# Altium schematic sheet Fuse_Power.SchDoc
size A4
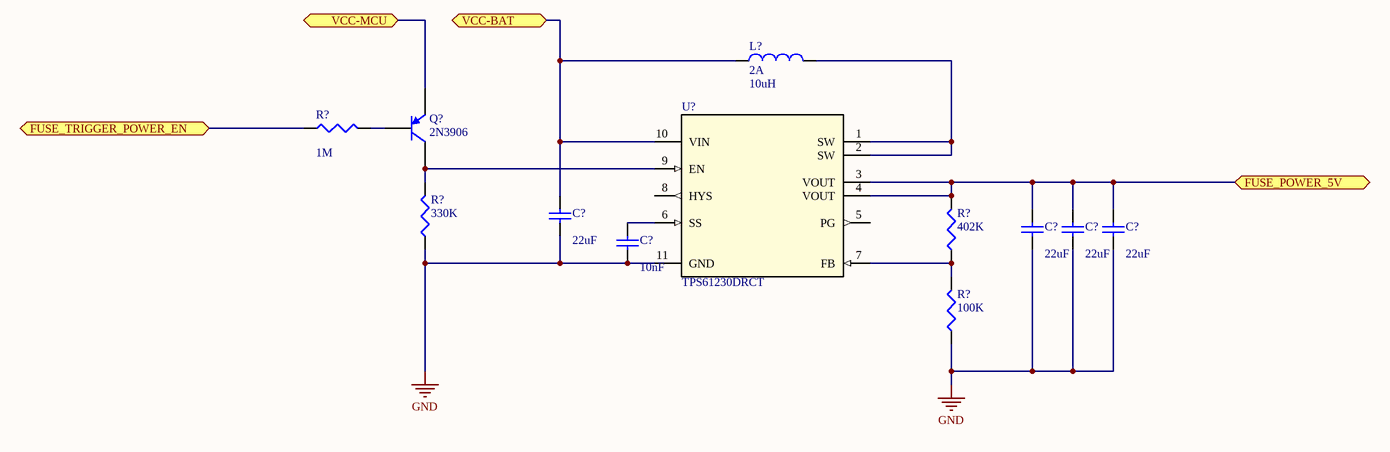
[diagram p0: Fuse_Power.SchDoc]

## Parts
(Parts that share a designator on the sheet are numbered #1, #2 ... from top to bottom, then left to right.)
C?#1  value 22uF  [C1206]  (hidden comment: Cap Semi)
C?#2  value 22uF  [C1206]  (hidden comment: Cap Semi)
C?#3  value 22uF  [C1206]  (hidden comment: Cap Semi)
C?#4  value 22uF  [C1206]  (hidden comment: Cap Semi)
C?#5  value 10nF  [C1206]  (hidden comment: Cap Semi)
L?  2A  value 10uH  [0402-A]
Q?  2N3906  [SOT-23B_N]
R?#1  value 1M  [12Z-2010]  (hidden comment: Res3)
R?#2  value 330K  [12Z-2010]  (hidden comment: Res3)
R?#3  value 402K  [12Z-2010]  (hidden comment: Res3)
R?#4  value 100K  [12Z-2010]  (hidden comment: Res3)
U?  TPS61230DRCT  [DRC0010G]

## Ports
FUSE_POWER_5V (bidir), FUSE_TRIGGER_POWER_EN (bidir), VCC-BAT (bidir), VCC-MCU (bidir)

## Nets
GND: C?#1.1 C?#2.1 C?#3.1 C?#4.1 C?#5.1 R?#2.1 R?#4.1 U?.11(GND)
FUSE_POWER_5V: C?#2.2 C?#3.2 C?#4.2 R?#3.2 U?.3(VOUT) U?.4(VOUT) ; port FUSE_POWER_5V
FUSE_TRIGGER_POWER_EN: R?#1.1 ; port FUSE_TRIGGER_POWER_EN
VCC-BAT: C?#1.2 L?.1 U?.10(VIN) ; port VCC-BAT
VCC-MCU: Q?.3(E) ; port VCC-MCU
NetC?#5_2: C?#5.2 U?.6(SS)
NetL?_2: L?.2 U?.1(SW) U?.2(SW)
NetQ?_1: Q?.1(C) R?#2.2 U?.9(EN)
NetQ?_2: Q?.2(B) R?#1.2
NetR?#3_1: R?#3.1 R?#4.2 U?.7(FB)

Not connected (* = marked no-connect by the designer): U? 5(PG) 8(HYS)

## Library data of the parts
C?#1-C?#5 = Cap Semi: Capacitor (Semiconductor SIM Model); Published: 8-Jun-2000; LatestRevisionDate: 29-May-2009; LatestRevisionNote: IPC-7351 Footprint Added.; PackageReference: C1206; Publisher: Altium Limited; PackageDescription: Chip Capacitor
L? = Inductor: Code_IEC: 1005; Published: 8-Jun-2000; LatestRevisionDate: 29-May-2009; LatestRevisionNote: IPC-7351 Footprint Added.; PackageReference: 0402-A; Publisher: Altium Limited; PackageDescription: Chip Inductor; Code_JEITA: 0402
Q? = PNP: PNP Bipolar Transistor; Published: 8-Jun-2000; LatestRevisionDate: 29-May-2009; LatestRevisionNote: IPC-7351 Footprint Added.; PackageVersion: Aug-1999; PackageReference: SOT-23B; Publisher: Altium Limited; PackageDescription: 3-Pin SOT-23 Package 0.95 mm Pitch, 2.4 mm Lead Span
R?#1-R?#4 = Res3: Resistor; Published: 8-Jun-2000; LatestRevisionDate: 29-May-2009; LatestRevisionNote: IPC-7351 Footprint Added.; PackageReference: J1-0603; Publisher: Altium Limited; PackageDescription: Chip Resistor
U? = TPS61230DRCT: Imported; Alternate Manufacturer: None; Manufacturer: Texas Instruments; CurrentTime: Not shown in title block; DocumentNumber: 1; SymbolCreator: a0411947; CompType: IC; U/M: EA; Designator: U?; PIN_COUNT: 11; CurrentDate: Not shown in title block; Time: Not shown in title block; Date: Not shown in title block; DocumentFullPathAndName: Not shown in title block; DocumentName: Not shown in title block; ModifiedDate: Not shown in title block; ApprovedBy: Not shown in title block; CheckedBy: Not shown in title block; Author: Not shown in title block; CompanyName: Not shown in title block; Engineer: Not shown in title block; Organization: Not shown in title block; Address1: Not shown in title block; Address2: Not shown in title block; Address3: Not shown in title block; Address4: Not shown in title block; Revision: Use project parameter SCH_Rev; SheetNumber: 1; SheetTotal: 1; ImagePath: Not shown in title block; Rule: *; ProjectName: *; SymbolVersion: 2014-03-05; PartNumber: TPS61230DRC; PackageReference: DRC0010G; MountType: SMT; ComponentLink1Description: Datasheet Link; ComponentLink1URL: https://sps06.itg.ti.com/sites/KMS/crossdivteams/altium/docs/ComponentDatasheets/TPS61230_SLVSAQ2_Jan 2014_preliminary.pdf; RoHS: Y; Publisher: Texas Instruments; LatestRevisionDate: 2014-03-10; RefDes: RefDes; Type: DEV; Value: Value